# EasyEDA schematic SCH_Radar-System_2024-05-14.json

## Sheets
1 Radar System Arduino Uno: TITLE: Radar System(Arduino Uno); REV: 1.0; Sheet: 1/1; Company: Robotonicc_Boy
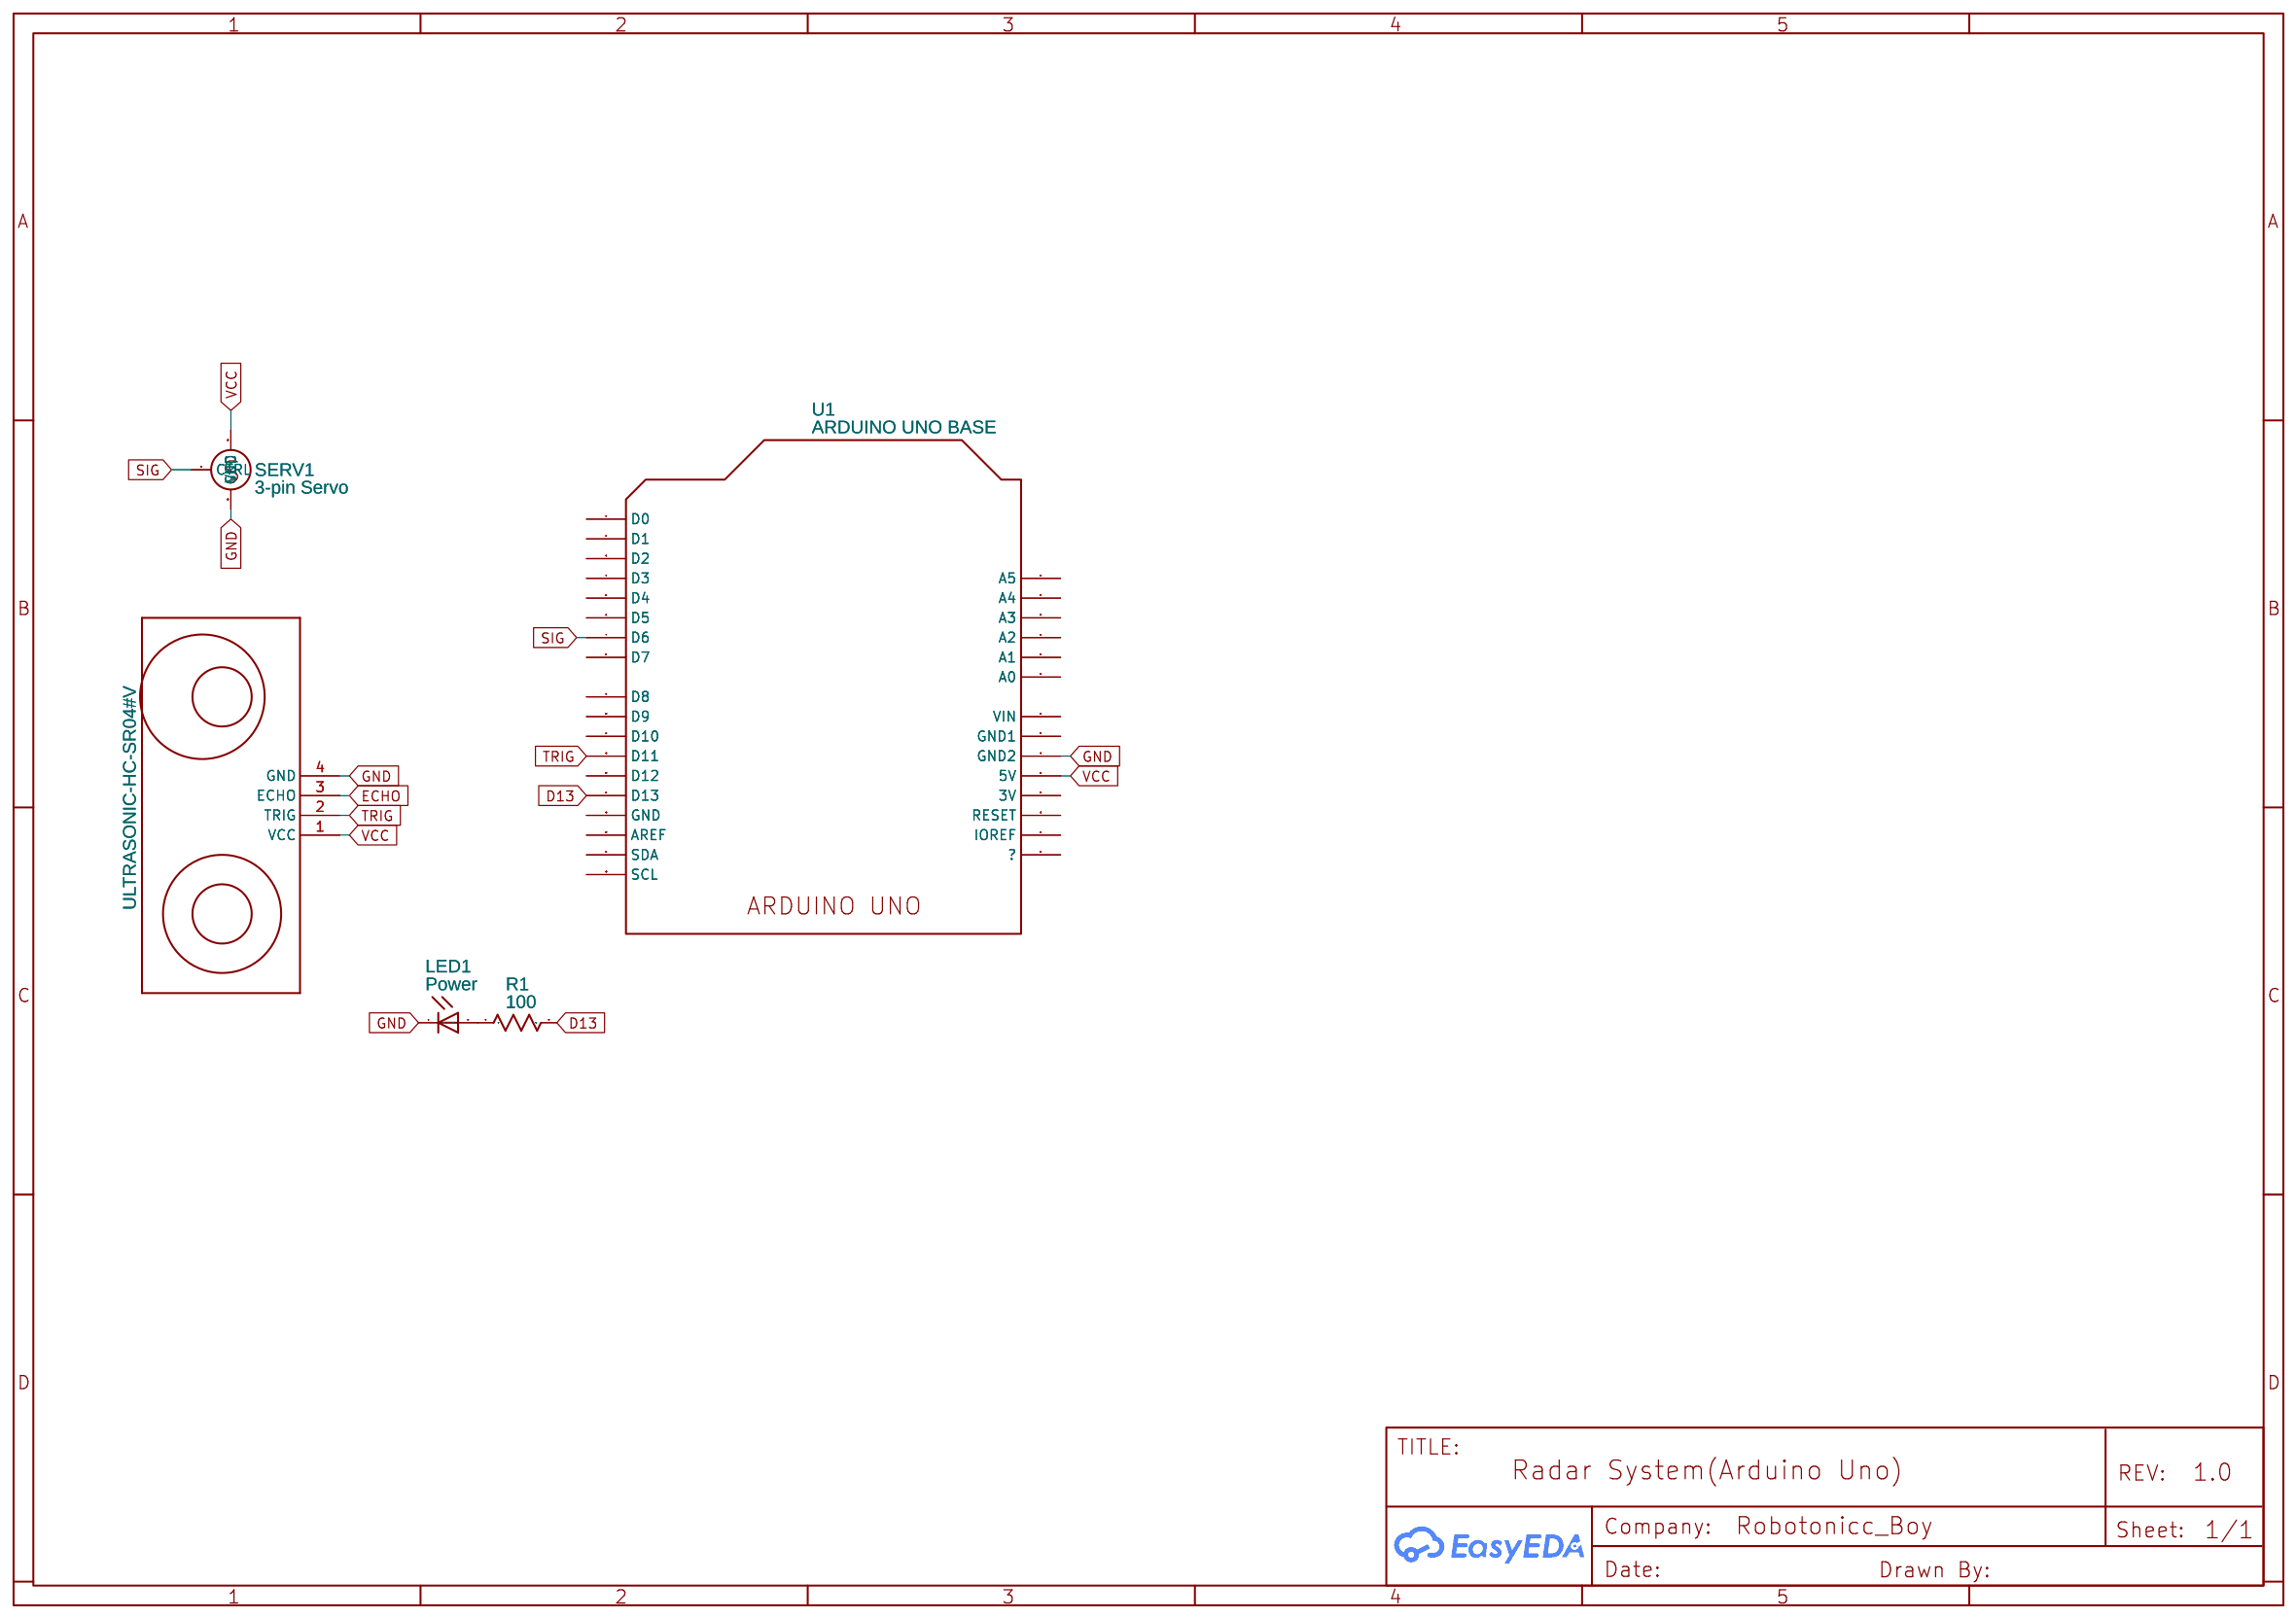
[diagram p0: Radar System Arduino Uno]
2 Radar System Arduino Nano: TITLE: Radar System(Arduino Nano); Company: Robotonicc Boy
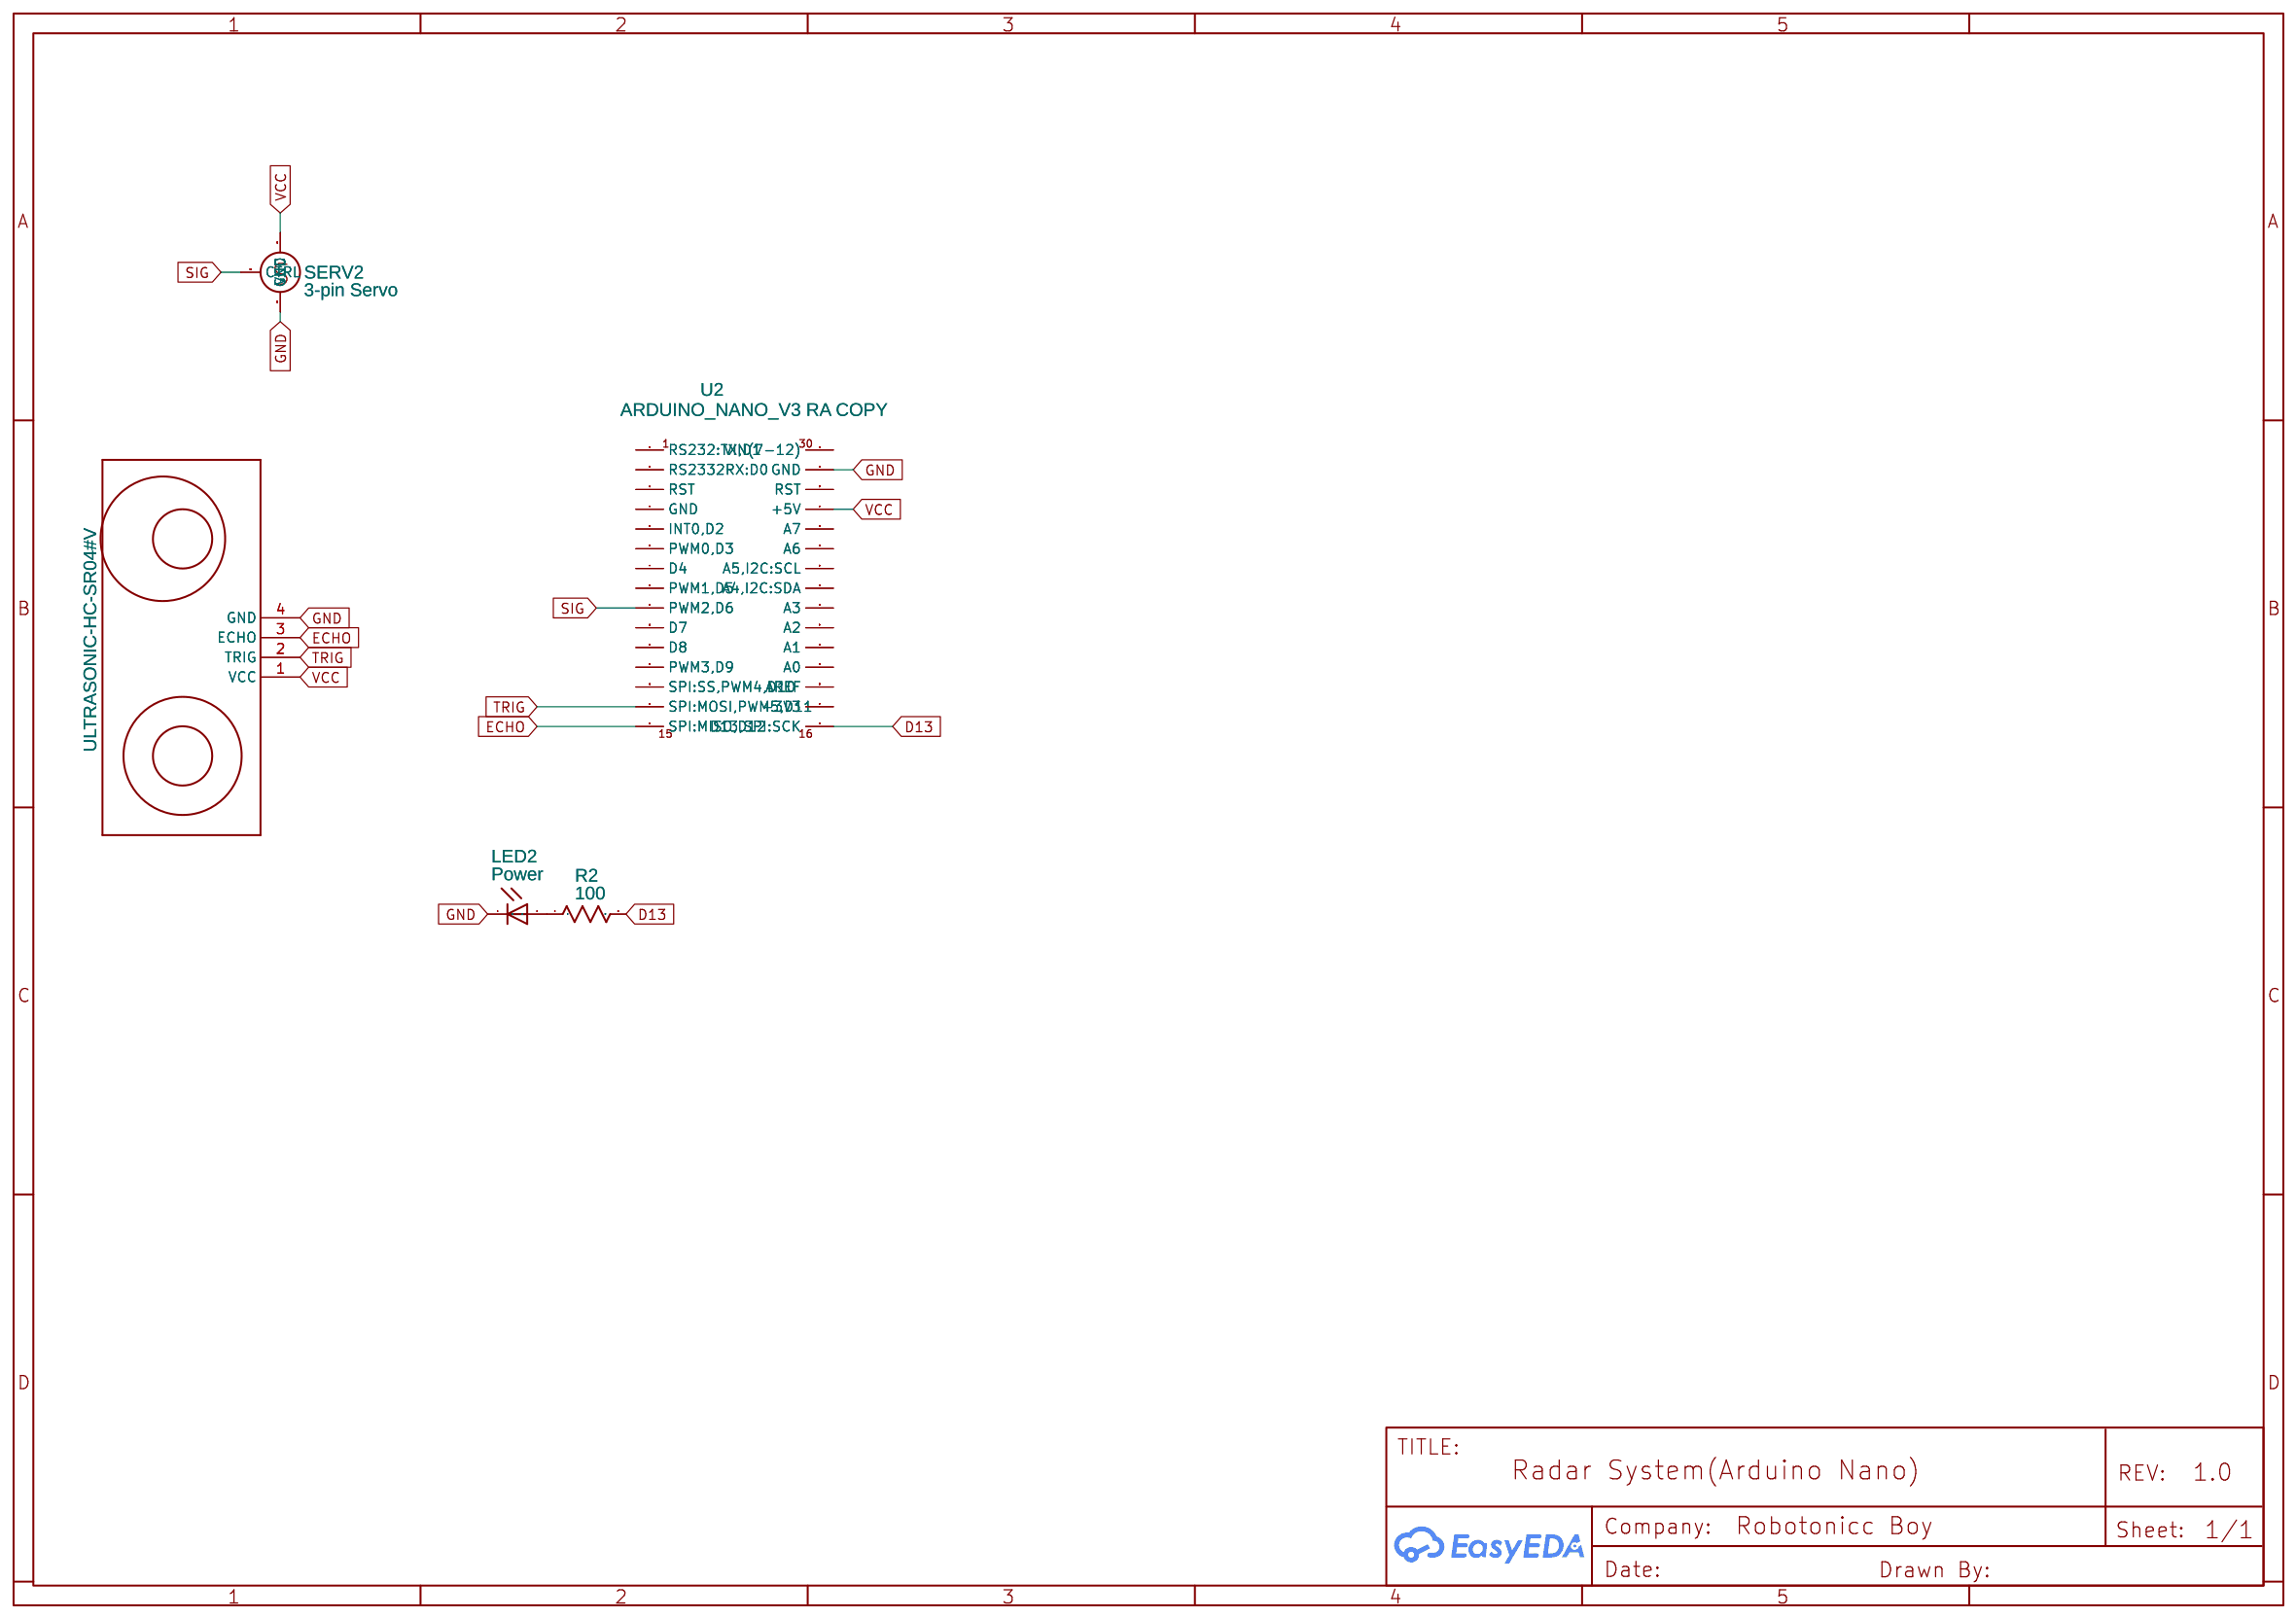
[diagram p1: Radar System Arduino Nano]

## Parts
sheet Radar System Arduino Nano
2  ULTRASONIC-HC-SR04#V  [ULTRASONIC SENSOR]
LED2  Power  [LED_LED5MM]
R2  100  [PKG-0.25W RESISTOR]
SERV2  3-pin Servo  [3-PIN SERVO]
U2  ARDUINO_NANO_V3 RA COPY  [ARDUINO-NANO-V3]
sheet Radar System Arduino Uno
1  ULTRASONIC-HC-SR04#V  [ULTRASONIC SENSOR]
LED1  Power  [LED_LED5MM]
R1  100  [PKG-0.25W RESISTOR]
SERV1  3-pin Servo  [3-PIN SERVO]
U1  ARDUINO UNO BASE  [UNO_R3;WO ARDUINO UNO]

## Library data of the parts
1 2 = ULTRASONIC-HC-SR04#V: Contributor: Heltsikkert; Package Display: No
LED1 LED2 = LED_LED5MM COPY2 COPY COPY: LED; Contributor: ahmad902
R1 R2 = MCF 0.25W 100R: Power: 1/4W; Tolerance: ±5%; Supplier Part: 9339043; Supplier: Element14; Manufacturer: MULTICOMP; link: https://www.farnell.com/datasheets/3436052.pdf; Contributor: Prof. Ing. F. Scordino
SERV1 SERV2 = 3-pin Servo: Contributor: Jacob+Caravaggio
U2 = ARDUINO_NANO_V3 RA COPY: Manufacturer Part: Arduino Nano; Contributor: sachingpta; Supplier Part: Nano_v3; Manufacturer: Arduino; link: https://store.arduino.cc/usa/arduino-nano
U1 = ARDUINO UNO BASE: Contributor: obaida.bohsas.shark; sourceId: frlCUcuMG

## Nets
GND: 1.4(GND) 2.4(GND) LED1.K(C) LED2.K(C) SERV1.GND SERV2.GND U1.27(GND2) U2.29(GND)
VCC: 1.1(VCC) 2.1(VCC) SERV1.VCC SERV2.VCC U1.28(5V) U2.27(+5V)
D13: R1.2 R2.2 U1.14(D13) U2.16(D13,SPI:SCK)
ECHO: 1.3(ECHO) 2.3(ECHO) U2.15(SPI:MISO,D12)
SIG: SERV1.CTRL SERV2.CTRL U1.7(D6) U2.9(PWM2,D6)
TRIG: 1.2(TRIG) 2.2(TRIG) U1.12(D11) U2.14(SPI:MOSI,PWM5,D11)
Net-(LED1-A): LED1.A R1.1
Net-(LED2-A): LED2.A R2.1

Not connected (* = marked no-connect by the designer): U1 1(D0) 2(D1) 3(D2) 4(D3) 5(D4) 6(D5) 8(D7) 9(D8) 10(D9) 11(D10) 13(D12) 15(GND) 16(AREF) 17(SDA) 18(SCL) 19(A5) 20(A4) 21(A3) 22(A2) 23(A1) 24(A0) 25(VIN) 26(GND1) 29(3V) 30(RESET) 31(IOREF) 32(?); U2 1(RS232:TX,D1) 2(RS2332RX:D0) 3(RST) 4(GND) 5(INT0,D2) 6(PWM0,D3) 7(D4) 8(PWM1,D5) 10(D7) 11(D8) 12(PWM3,D9) 13(SPI:SS,PWM4,D10) 17(+3V3) 18(AREF) 19(A0) 20(A1) 21(A2) 22(A3) 23(A4,I2C:SDA) 24(A5,I2C:SCL) 25(A6) 26(A7) 28(RST) 30(VIN(7-12))
